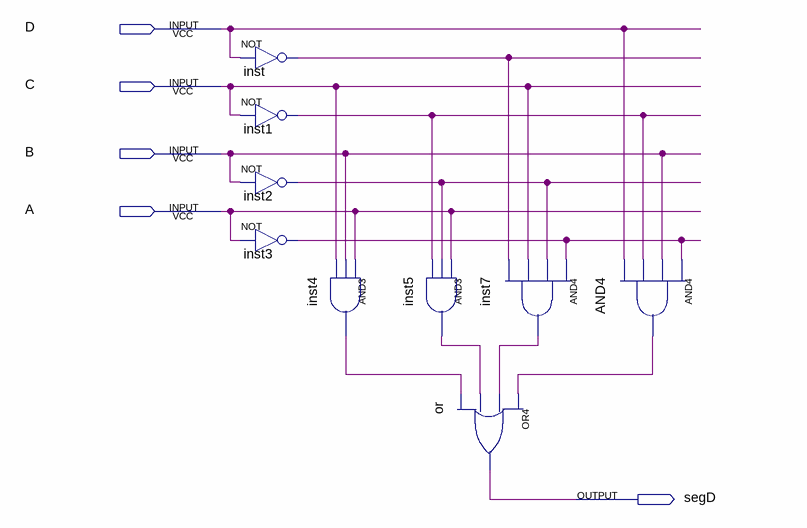
[diagram p0: schematic sheet]
// Quartus schematic segD.bdf as structural Verilog: 9 symbols, 5 pins
module segD (
  input  D,
  input  C,
  input  B,
  input  A,
  output segD
);

  wire AND4_out, inst1_out, inst2_out, inst3_out, inst4_out, inst5_out, inst7_out, inst_out;

  not inst (inst_out, D);
  not inst1 (inst1_out, C);
  not inst2 (inst2_out, B);
  not inst3 (inst3_out, A);
  and inst4 (inst4_out, A, B, C);
  and inst5 (inst5_out, A, inst2_out, inst1_out);
  or \or  (segD, AND4_out, inst7_out, inst5_out, inst4_out);
  and inst7 (inst7_out, inst3_out, inst2_out, C, inst_out);
  and AND4 (AND4_out, inst3_out, B, inst1_out, D);
endmodule
